# EAGLE design strain-gauge-amplifer-v1 (EAGLE 6.4)
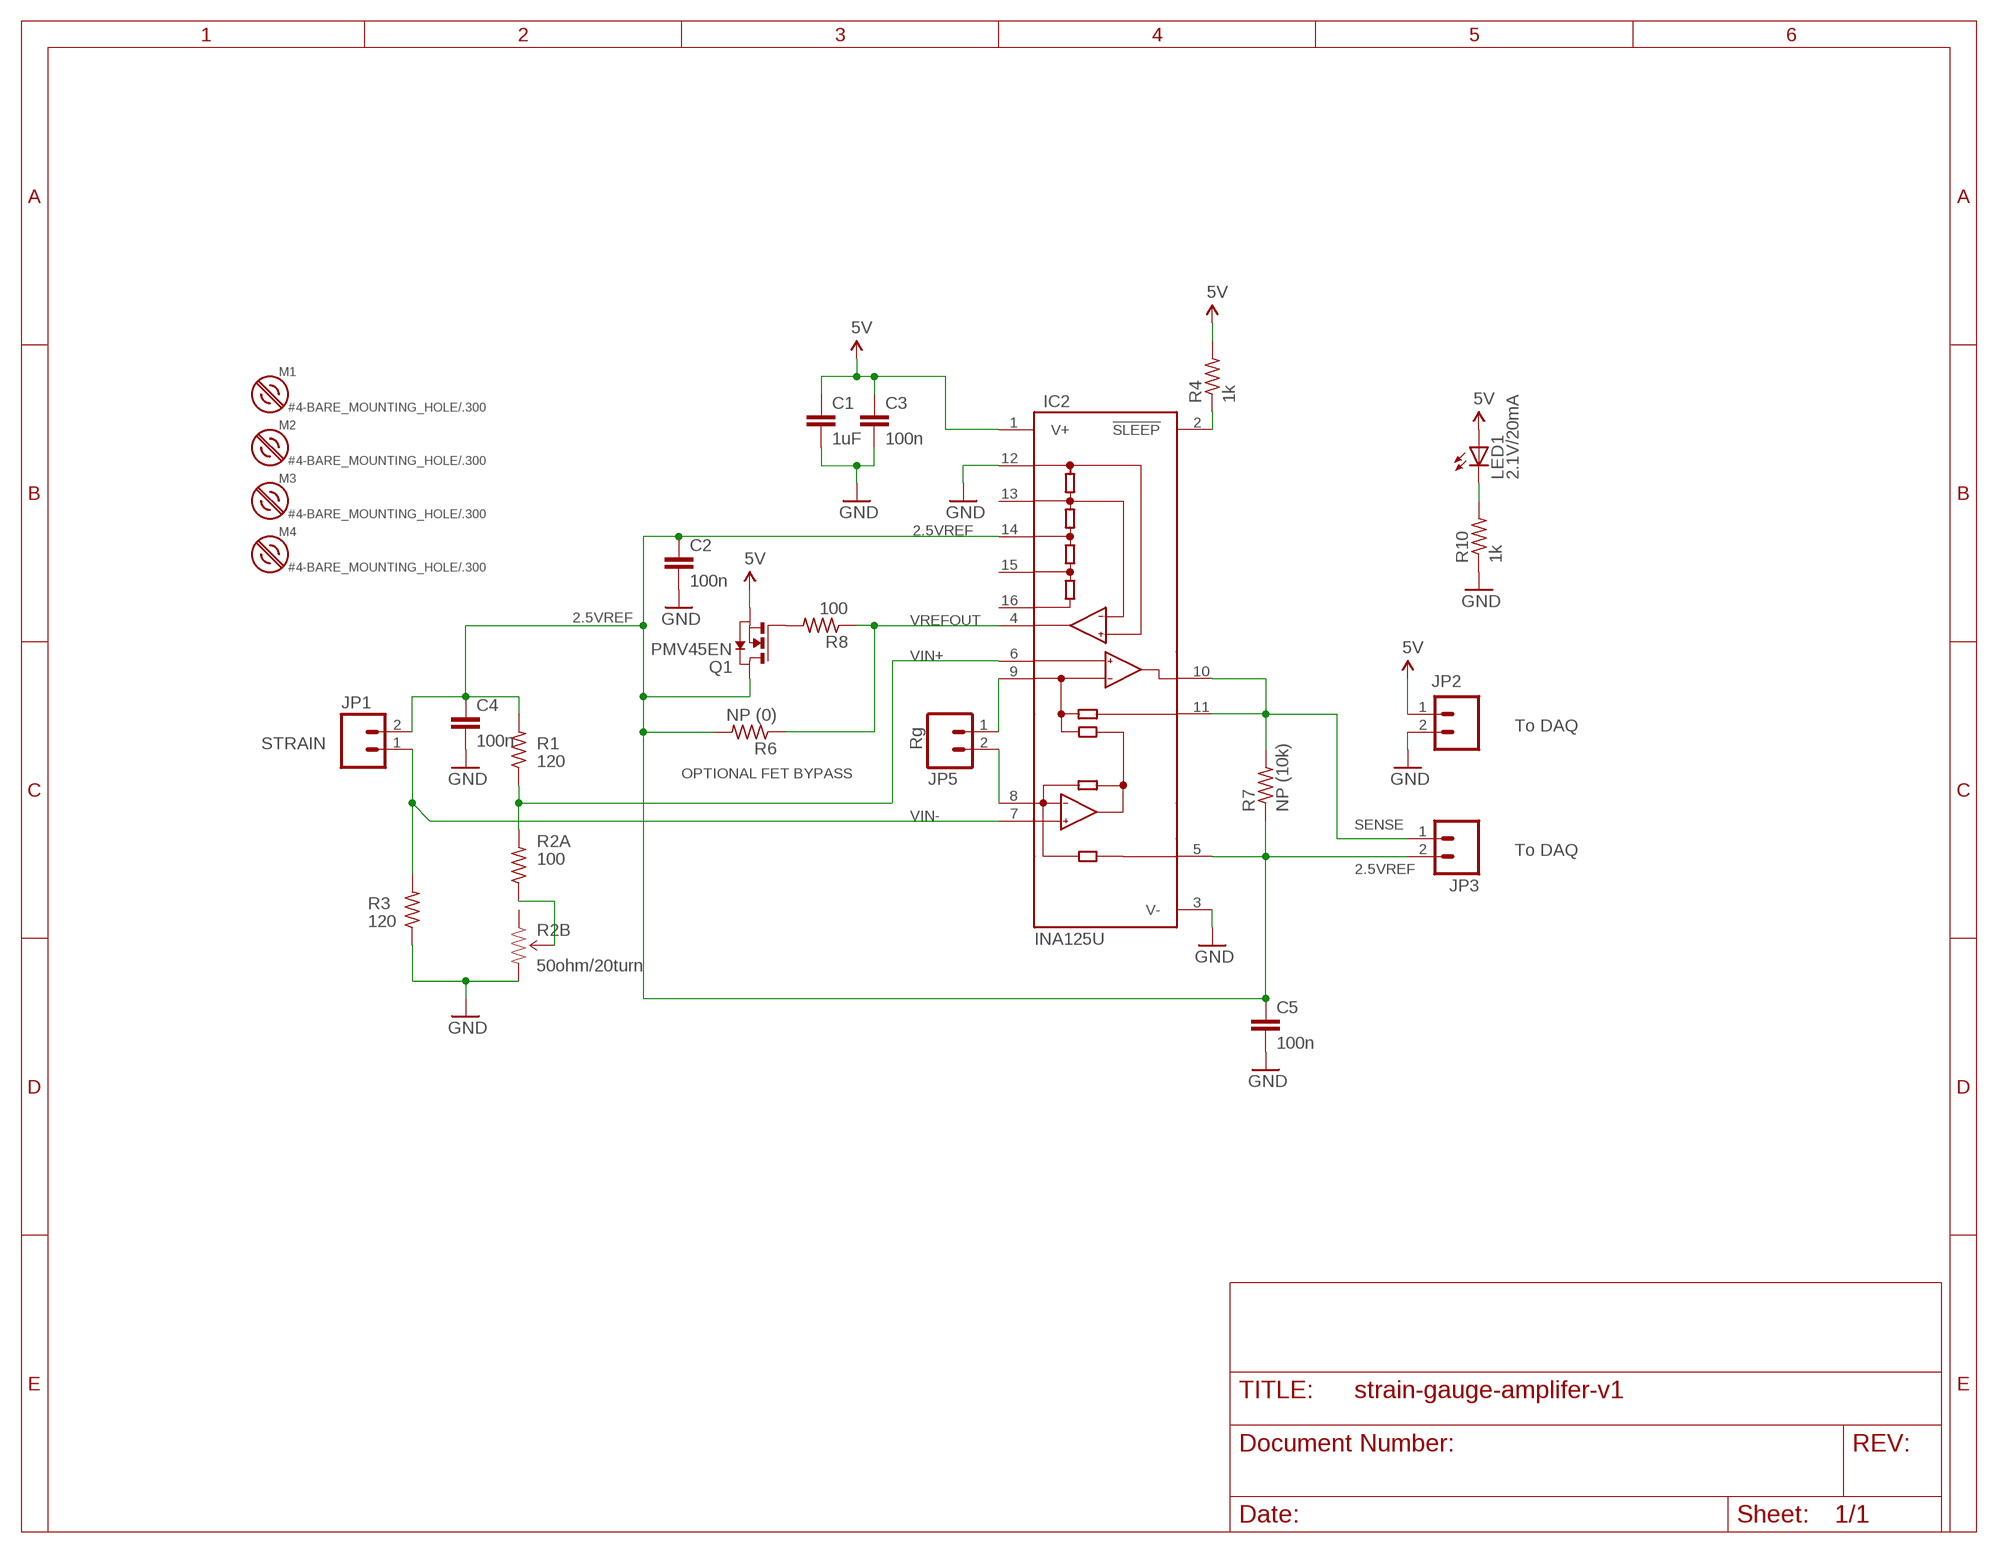
[diagram p0: schematic, sheet 1]

## Parts
C1  1uF  C-EU0805-C-NOSILK  [0805-C-NOSILK]
C2  100n  C-EU0805-C-NOSILK  [0805-C-NOSILK]
C3  100n  C-EU0805-C-NOSILK  [0805-C-NOSILK]
C4  100n  C-EU0805-C-NOSILK  [0805-C-NOSILK]
C5  100n  C-EU0805-C-NOSILK  [0805-C-NOSILK]
IC2  INA125U  [SO16-1]
JP1  STRAIN  M025MM  [SCREWTERMINAL-5MM-2]
JP2  M025MM  [SCREWTERMINAL-5MM-2]
JP3  M025MM  [SCREWTERMINAL-5MM-2]
JP5  Rg  M025MM  [SCREWTERMINAL-5MM-2]
LED1  2.1V/20mA  LED0603  [LED-0603]
M1  #4-BARE_MOUNTING_HOLE/.300  [#4/.300-BARE+STD_NUT_OR_STAR_WASHER]
M2  #4-BARE_MOUNTING_HOLE/.300  [#4/.300-BARE+STD_NUT_OR_STAR_WASHER]
M3  #4-BARE_MOUNTING_HOLE/.300  [#4/.300-BARE+STD_NUT_OR_STAR_WASHER]
M4  #4-BARE_MOUNTING_HOLE/.300  [#4/.300-BARE+STD_NUT_OR_STAR_WASHER]
Q1  PMV45EN  [SOT23]
R1  120  R-US_0805-C-NOSILK  [0805-C-NOSILK]
R2A  100  R-US_0805-C-NOSILK  [0805-C-NOSILK]
R2B  50ohm/20turn  TRIMPOTTRIMPOT-5MM  [TRIMPOT-5MM]
R3  120  R-US_0805-C-NOSILK  [0805-C-NOSILK]
R4  1k  R-US_0805-C-NOSILK  [0805-C-NOSILK]
R6  NP (0)  R-US_0805-C-NOSILK  [0805-C-NOSILK]
R7  NP (10k)  R-US_0805-C-NOSILK  [0805-C-NOSILK]
R8  100  R-US_0805-C-NOSILK  [0805-C-NOSILK]
R10  1k  R-US_0805-C-NOSILK  [0805-C-NOSILK]

## Nets
2.5VREF: C2.1 C4.1 C5.1 IC2.5(REF) IC2.14(REF2.5) JP1.2 JP3.2 Q1.3(D) R1.2 R6.2 R7.1
5V: C1.1 C3.1 IC2.1(V+) JP2.1 LED1.A Q1.2(S) R4.2
GND: C1.2 C2.2 C3.2 C4.2 C5.2 IC2.3(V-) IC2.12(REFCOM) JP2.2 R2B.C(CW) R3.1 R10.1
N$1: R2A.1 R2B.B(WIPER)
N$3: IC2.9(RG) JP5.1
N$5: IC2.8(RG) JP5.2
N$6: Q1.1(G) R8.2
N$8: IC2.2(!SLEEP) R4.1
N$11: LED1.C R10.2
SENSE: IC2.10(OUT) IC2.11(SENSE) JP3.1 R7.2
VIN+: IC2.6(+IN) R1.1 R2A.2
VIN-: IC2.7(-VIN) JP1.1 R3.2
VREFOUT: IC2.4(REFOUT) R6.1 R8.1
Unconnected: IC2.13(REFBG) IC2.15(REF5) IC2.16(REF10) R2B.A(CCW)

## Notes on the sheet
- To DAQ
- OPTIONAL FET BYPASS
- To DAQ

## Library data of the parts
C1-C5 = rcl_custom:C-EU: CAPACITOR, European symbol
IC2 = burr-brown:INA125: Instrumentation Amplifier with Precision Voltage Reference; MF: TEXAS INSTRUMENT CONNECTORS; MPN: INA125U; OC_FARNELL: 1304375; OC_NEWARK: 80K5901
JP1-JP3 JP5 = SparkFun-Connectors:M02: Header 2 Standard 2-pin 0.1" header. Use with straight break away headers (SKU : PRT-00116), right angle break away headers (PRT-00553), swiss pins (PRT-00743), machine pins (PRT-00117), and female headers (PRT-00115). Molex polarized connector foot print use with SKU : PRT-08233 with associated crimp pins and housings.
LED1 = SparkFun-LED:LED: LEDs Standard schematic elements and footprints for 5mm, 3mm, 1206, and 0603 sized LEDs. 5mm - Spark Fun Electronics SKU : COM-00529 (and others)
M1-M4 = mount:#4-BARE_MOUNTING_HOLE: 1/8" drill hole for #4 screw mount
Q1 = Q_PMV45EN_N_ch_MOSFET:PMV45EN
R1 R2A R3 R4 R6-R8 R10 = rcl_custom:R-US_: RESISTOR, American symbol
R2B = SparkFun-Electromechanical:TRIMPOT: Various small potentiometers for "set-and-forget" applications

## Board
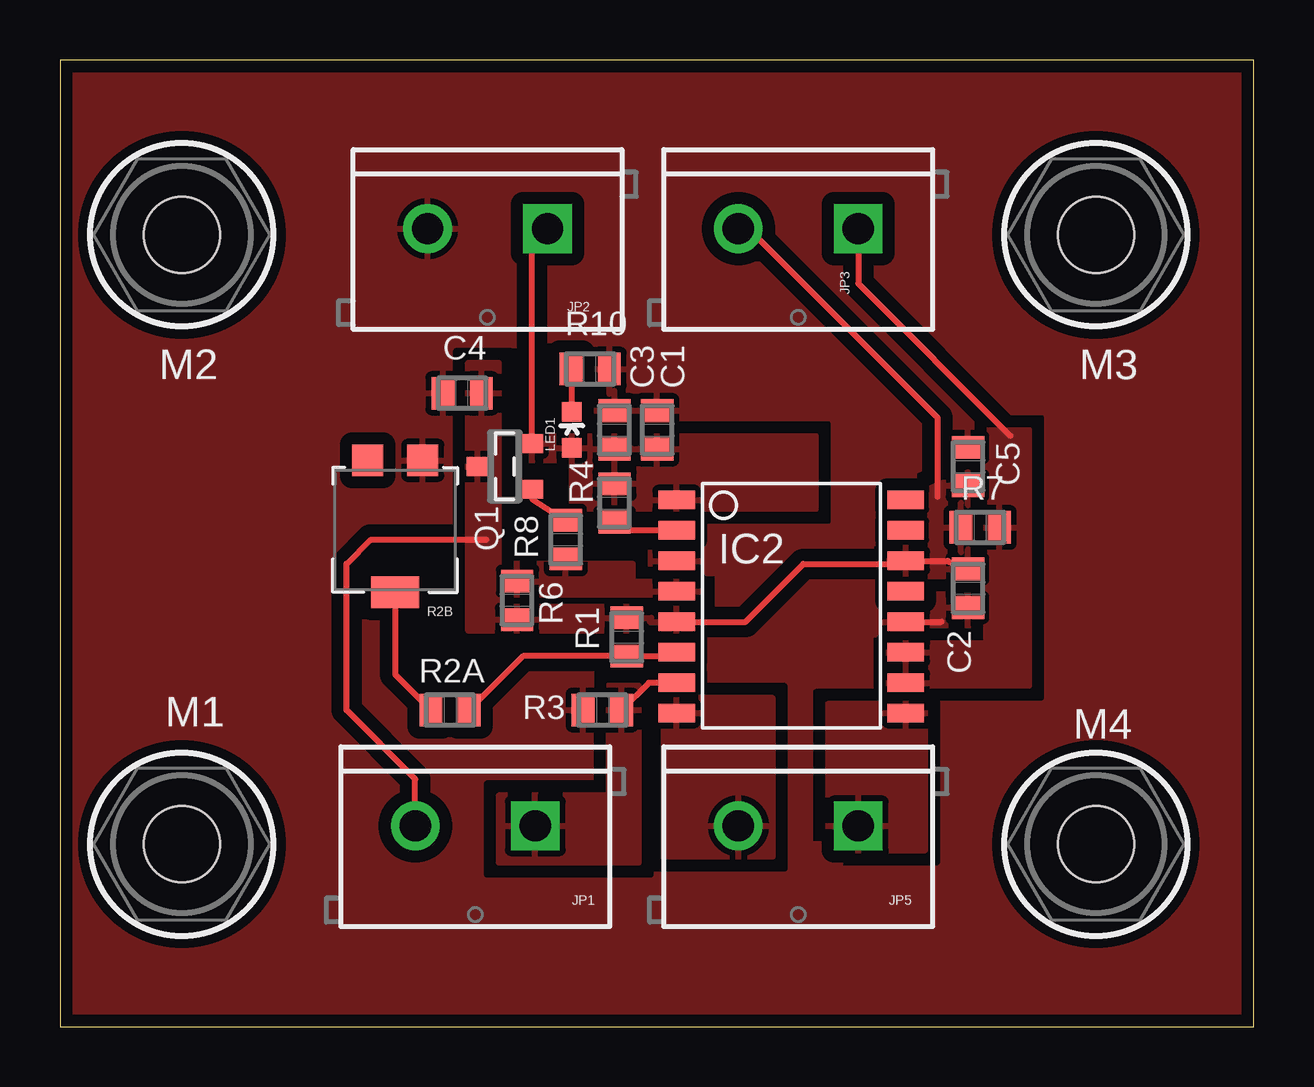
[diagram p1: board, top side]
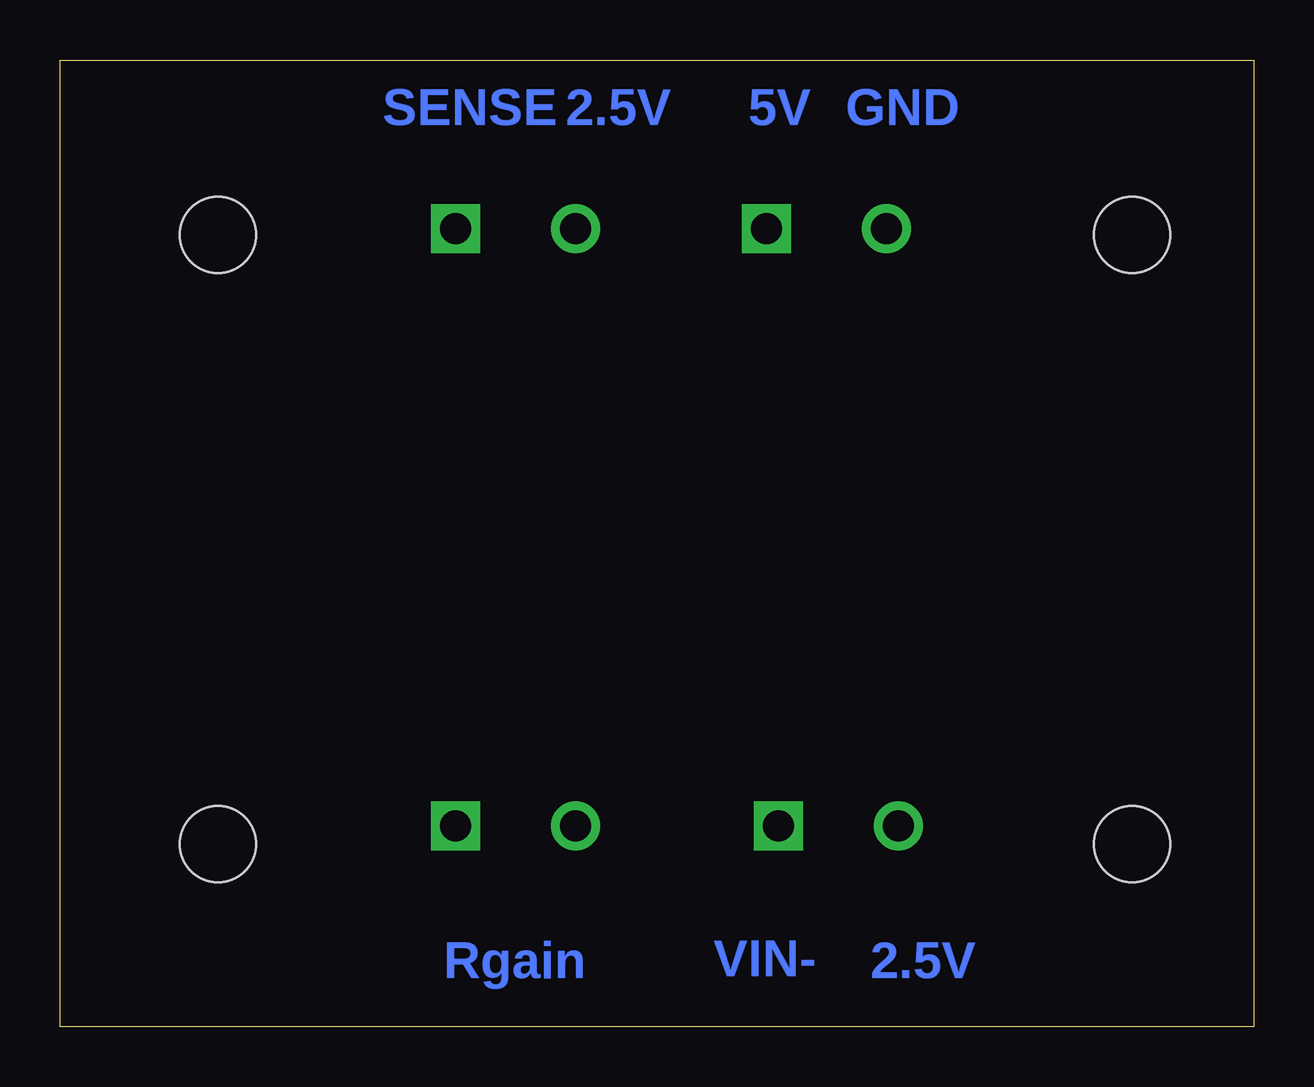
[diagram p2: board, bottom side, seen from below]

Size 49.76 x 40.31 mm. Coordinates in mm from the lower left corner, seen from the top.
Outline: 0,0 49.76,0 49.76,40.31 0,40.31 0,0
Copper layers (1*16): Top 0.0178mm / dielectric 59mil / Bottom 0.0178mm
Design rules "epl-lpkf": minimum track width 8mil, minimum drill 0.35mm, track to track 8mil, track to pad 8mil, pad to pad 8mil, via to via 8mil, smd to smd 8mil, copper to edge 15mil, drill to drill 15mil, minimum pad ring 8mil, minimum via ring 8mil, stop-mask expansion 3mil, vias tented up to drill 0mil, thermal gap 10mil

### Footprints (pad centres in the part's own frame; a part is rotated, then mirrored left to right if it is on the bottom)
0805-C-NOSILK = smd 0.95 x 1.35: 1 -0.8,0; 2 0.8,0
SO16-1 = smd 0.762 x 1.524: 1 -4.445,-4.775; 2 -3.175,-4.775; 3 -1.905,-4.775; 4 -0.635,-4.775; 5 0.635,-4.775; 6 1.905,-4.775; 7 3.175,-4.775; 8 4.445,-4.775; 9 4.445,4.775; 10 3.175,4.775; 11 1.905,4.775; 12 0.635,4.775; 13 -0.635,4.775; 14 -1.905,4.775; 15 -3.175,4.775; 16 -4.445,4.775
SCREWTERMINAL-5MM-2 = drill 1.3 pad 2.032 square: 1 0,0 | drill 1.3 pad 2.032: 2 5,0
LED-0603 = smd 0.8 x 0.8: A 0,-0.75; C 0,0.75
#4/.300-BARE+STD_NUT_OR_STAR_WASHER = hole 3.175: 0,0
SOT23 = smd 0.787 x 0.889: 1 -0.953,-1.143; 2 0.953,-1.143; 3 0,1.143
TRIMPOT-5MM = smd 1.3 x 1.3: A 1.15,-2.54; C -1.15,-2.54 | smd 2 x 1.3: B 0,2.96

### Placement (x,y rotation side)
C1  24.89,24.89 90 top
C2  37.85,18.29 270 top
C3  23.11,24.89 90 top
C4  16.76,26.42 180 top
C5  37.85,23.37 90 top
IC2  30.48,17.53 270 top
JP1  19.81,8.38 180 top
JP2  20.32,33.27 180 top
JP3  33.27,33.27 180 top
JP5  33.27,8.38 180 top
LED1  21.34,24.89 0 top
M1  5.08,7.62 0 top
M2  5.08,33.02 0 top
M3  43.18,33.02 0 top
M4  43.18,7.62 0 top
Q1  18.54,23.37 90 top
R1  23.62,16.26 90 top
R2A  16.26,13.21 0 top
R2B  13.97,21.08 180 top
R3  22.61,13.21 0 top
R4  23.11,21.84 90 top
R6  19.05,17.78 270 top
R7  38.35,20.83 0 top
R8  21.08,20.32 90 top
R10  22.1,27.43 180 top

### Tracks (layer width: path | path; a pad name or v marks a point on that pad's centre or on a via)
2.5VREF
  Top 0.254: IC2.5 28.57,16.89 30.99,19.3 35.13,19.3 IC2.14 36.99,19.43 C2.1 | JP1.2 14.81,10.33 11.94,13.21 11.94,19.3 12.95,20.32 17.78,20.32 | JP3.2 28.7,33.27 36.32,25.65 36.58,25.4 36.58,22.1
  pour Top: 26.67,16.51 17.02,16.51 17.02,27.69 18.29,27.69 18.29,17.53 26.67,17.53
  pour Top (rank 2): 34.54,18.8 37.85,18.8 37.85,23.11 36.07,22.35 34.54,22.35
5V
  Top 0.254: Q1.2 19.68,32.64 JP2.1
  pour Top: 19.3,24.64 31.5,24.64 31.5,21.59 21.34,21.59 21.34,23.62 19.3,23.62
GND
  Top 0.254: IC2.12 36.74,16.89
  pour Top (isolate 0.508, rank 5): 0,40.13 49.78,40.39 49.78,0 0,0
N$1
  Top 0.254: R2B.B 13.97,14.69 R2A.1
N$3
  pour Top: 36.07,13.46 32,13.46 32,7.37 36.07,7.37
N$5
  pour Top: 29.72,13.72 25.15,13.72 25.15,7.11 29.72,7.11
N$6
  Top 0.254: Q1.1 19.68,22.01 R8.2
N$8
  Top 0.254: IC2.2 23.46,20.7 R4.1
N$11
  Top 0.254: LED1.C 21.34,27.39 R10.2
SENSE
  Top 0.254: JP3.1 33.27,30.99 39.62,24.64
  pour Top: 40.39,24.89 40.39,14.22 34.54,14.22 34.54,16 38.61,16 38.61,24.89
VIN+
  Top 0.254: IC2.6 25.54,15.46 R1.1 19.3,15.46 R2A.2
VIN-
  Top 0.254: IC2.7 24.55,14.35 R3.2
  pour Top: 18.29,6.86 24.13,6.86 24.13,14.22 22.86,14.22 22.86,9.65 18.29,9.65
VREFOUT
  pour Top (rank 2): 26.67,18.54 23.88,18.54 23.88,19.3 18.29,19.3 18.29,18.03 26.67,18.03

### Text on the board
Bottom: GND | 5V | 2.5V | SENSE | VIN- | 2.5V | Rgain